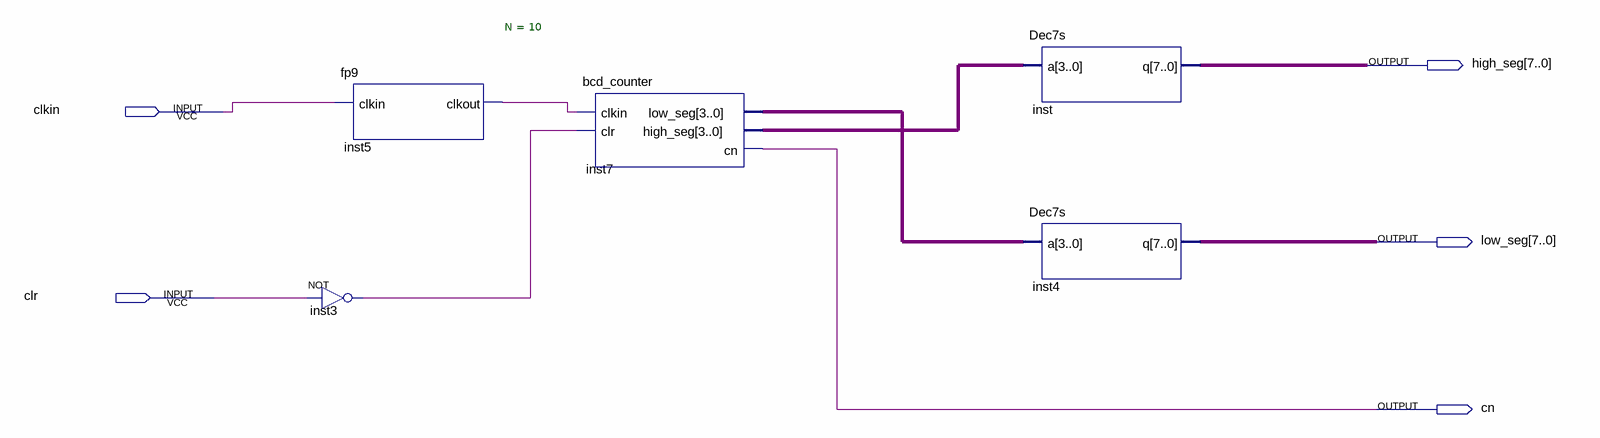
[diagram p0: schematic sheet]
// Quartus schematic Block1.bdf as structural Verilog: 5 symbols, 5 pins
module Block1 (
  input  clkin,
  input  clr,
  output [7:0] high_seg,
  output [7:0] low_seg,
  output cn
);

  wire inst3_out, inst5_clkout;
  wire [3:0] inst7_high_seg, inst7_low_seg;

  not inst3 (inst3_out, clr);
  fp9 #(.N(10)) inst5 (.clkin(clkin), .clkout(inst5_clkout));
  bcd_counter inst7 (
    .clkin(inst5_clkout), .clr(inst3_out), .low_seg(inst7_low_seg), .high_seg(inst7_high_seg), .cn(cn));
  Dec7s inst (.a(inst7_high_seg), .q(high_seg));
  Dec7s inst4 (.a(inst7_low_seg), .q(low_seg));
endmodule
